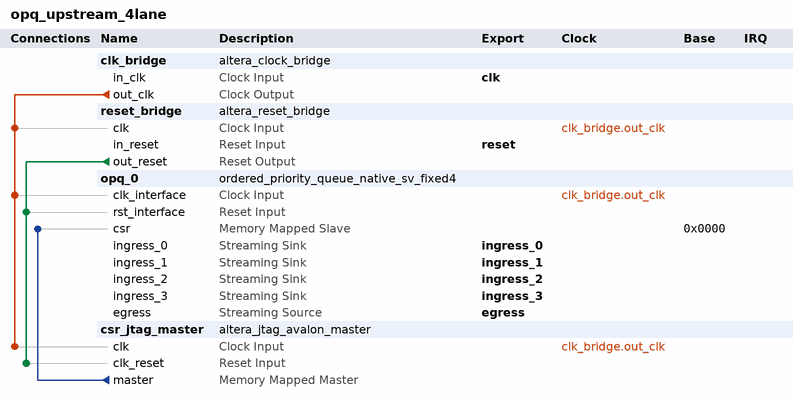
[diagram p0: system contents]
# Platform Designer (Qsys) system opq_upstream_4lane, Arria 10 10AS066H1F34E1SG
# Parameters at their usual value, and those the tool derives, are not listed.
package require -exact qsys 18.1
create_system opq_upstream_4lane
set_project_property DEVICE_FAMILY {Arria 10}
set_project_property DEVICE 10AS066H1F34E1SG

add_instance clk_bridge altera_clock_bridge 18.1
set_instance_parameter_value clk_bridge DERIVED_CLOCK_RATE 0
set_instance_parameter_value clk_bridge EXPLICIT_CLOCK_RATE 0

add_instance reset_bridge altera_reset_bridge 18.1
set_instance_parameter_value reset_bridge ACTIVE_LOW_RESET 0
set_instance_parameter_value reset_bridge SYNCHRONOUS_EDGES deassert

add_instance opq_0 ordered_priority_queue_native_sv_fixed4 26.4.15.428
set_instance_parameter_value opq_0 BUILD 428
set_instance_parameter_value opq_0 INSTANCE_ID 0
set_instance_parameter_value opq_0 IP_UID 1330663757
set_instance_parameter_value opq_0 VERSION_DATE 20260428
set_instance_parameter_value opq_0 VERSION_GIT 1332117425
set_instance_parameter_value opq_0 VERSION_MAJOR 26
set_instance_parameter_value opq_0 VERSION_MINOR 4
set_instance_parameter_value opq_0 VERSION_PATCH 15

add_instance csr_jtag_master altera_jtag_avalon_master 18.1
set_instance_parameter_value csr_jtag_master FAST_VER 1

# connections
add_connection clk_bridge.out_clk csr_jtag_master.clk clock
add_connection clk_bridge.out_clk opq_0.clk_interface clock
add_connection clk_bridge.out_clk reset_bridge.clk clock
add_connection reset_bridge.out_reset csr_jtag_master.clk_reset reset
add_connection reset_bridge.out_reset opq_0.rst_interface reset
add_connection csr_jtag_master.master opq_0.csr avalon
set_connection_parameter_value csr_jtag_master.master/opq_0.csr baseAddress 0x0000

# exported interfaces
add_interface clk clock sink
set_interface_property clk EXPORT_OF clk_bridge.in_clk
add_interface egress avalon_streaming source
set_interface_property egress EXPORT_OF opq_0.egress
add_interface ingress_0 avalon_streaming sink
set_interface_property ingress_0 EXPORT_OF opq_0.ingress_0
add_interface ingress_1 avalon_streaming sink
set_interface_property ingress_1 EXPORT_OF opq_0.ingress_1
add_interface ingress_2 avalon_streaming sink
set_interface_property ingress_2 EXPORT_OF opq_0.ingress_2
add_interface ingress_3 avalon_streaming sink
set_interface_property ingress_3 EXPORT_OF opq_0.ingress_3
add_interface reset reset sink
set_interface_property reset EXPORT_OF reset_bridge.in_reset

set_interconnect_requirement {$system} qsys_mm.clockCrossingAdapter HANDSHAKE
set_interconnect_requirement {$system} qsys_mm.enableEccProtection FALSE
set_interconnect_requirement {$system} qsys_mm.insertDefaultSlave FALSE
set_interconnect_requirement {$system} qsys_mm.maxAdditionalLatency 1
set_interconnect_requirement csr_jtag_master.master qsys_mm.security NON_SECURE

save_system opq_upstream_4lane.qsys
